# Altium schematic sheet Debugger.SchDoc
size A4; SheetNumber: 8; SheetTotal: 8
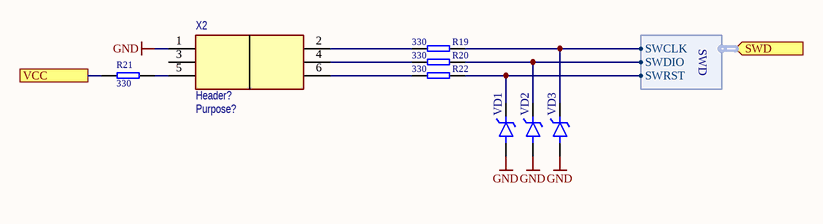
[diagram p0: Debugger.SchDoc]

## Parts
R19  value 330  [RES 0402]
R20  value 330  [RES 0402]
R21  value 330  [RES 0402]  (no BOM)
R22  value 330  [RES 0402]
VD1  DiodeTVSs  [SOD-323]  (value not drawn)
VD2  DiodeTVSs  [SOD-323]  (value not drawn)
VD3  DiodeTVSs  [SOD-323]  (value not drawn)
X2  Header?  Purpose: Purpose?  [PBD-6-2.54]

## Ports
SWD (in, harness SWD), VCC

## Harnesses
SWD: SWDIO, SWCLK, SWRST

## Nets
GND: VD1.A(Anode) VD2.A(Anode) VD3.A(Anode) X2.1
VCC: R21.2 ; port VCC
NetR19_1: R19.1 X2.2
NetR19_2: R19.2 VD3.C(Cathode) ; port SWD.SWCLK
NetR20_1: R20.1 X2.4
NetR20_2: R20.2 VD2.C(Cathode) ; port SWD.SWDIO
NetR21_1: R21.1 X2.5
NetR22_1: R22.1 X2.6
NetR22_2: R22.2 VD1.C(Cathode) ; port SWD.SWRST

Not connected (* = marked no-connect by the designer): X2 3

## Library data of the parts
R19-R22 = !Resistor: Resistor; IsSMT: NoSMT
VD1-VD3 = DiodeTVSs: Diode TVS Single; IsSMT: NoSMT; Order: *; BuyLink1: *; LCSC Part #: *
X2 = Header 2x3: 3x2 header; IsSMT: NoSMT